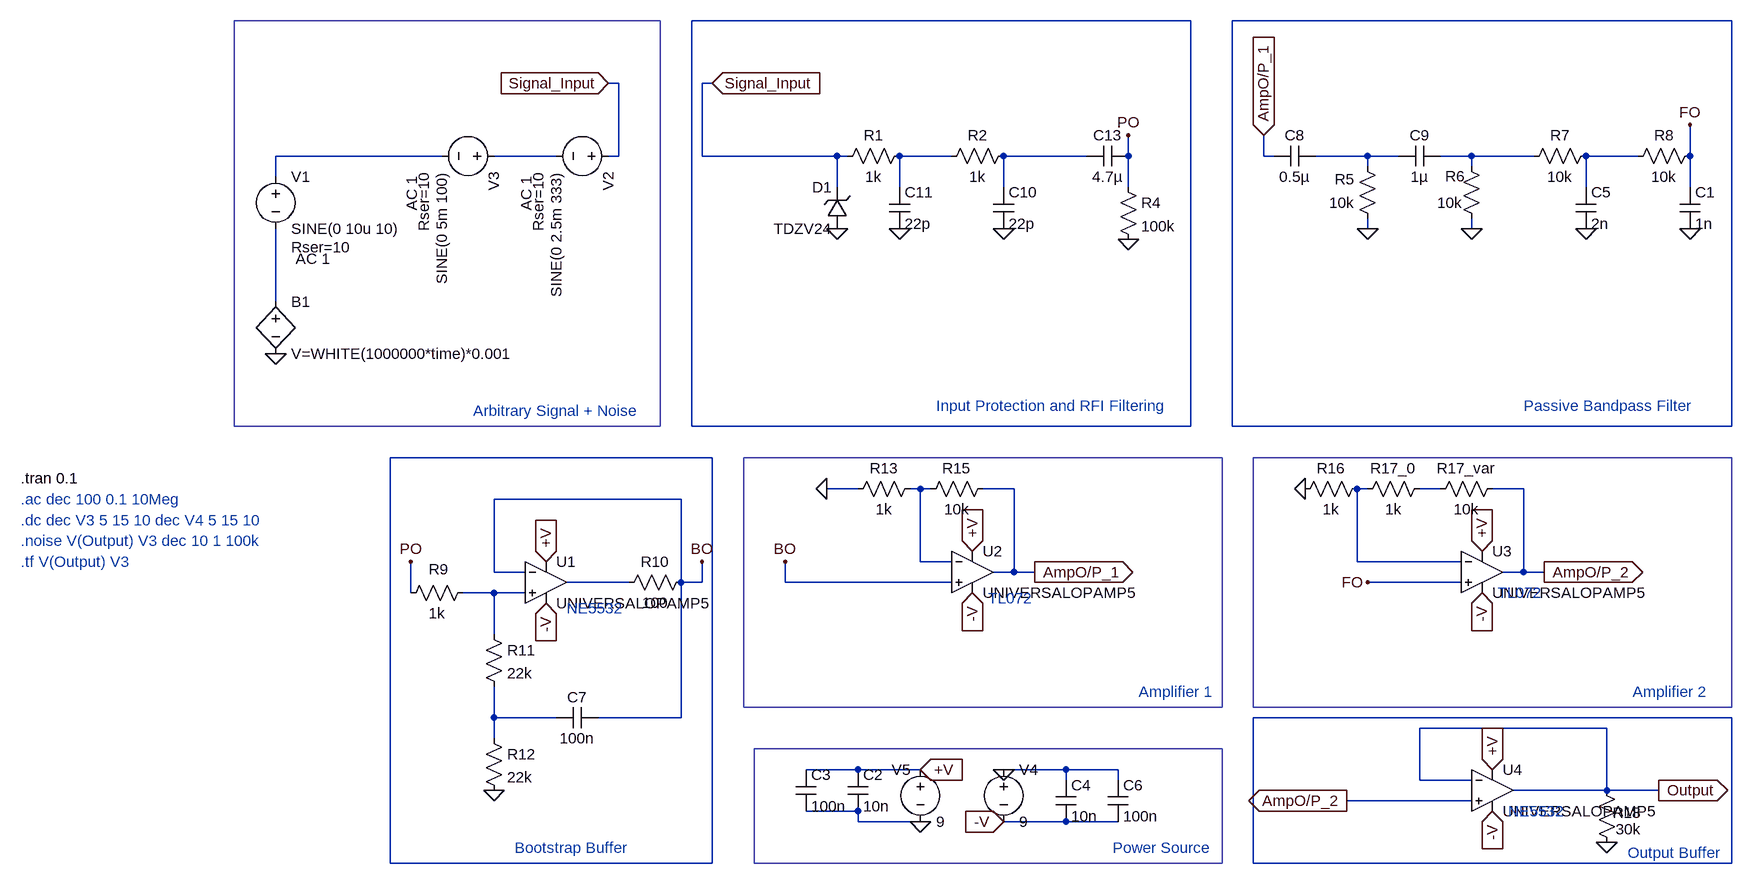
[diagram p0: schematic Low-Level Audio Signal Conditioning Preamplifier.asc]
Low-Level Audio Signal Conditioning Preamplifier.asc, the LTspice schematic file:
Version 4
SHEET 1 4140 1256
WIRE 1152 -48 384 -48
WIRE 1984 -48 1216 -48
WIRE 272 48 256 48
WIRE 416 48 400 48
WIRE 0 160 -256 160
WIRE 176 160 80 160
WIRE 272 160 272 48
WIRE 272 160 256 160
WIRE 400 160 400 48
WIRE 608 160 400 160
WIRE 624 160 608 160
WIRE 784 160 704 160
WIRE 992 160 864 160
WIRE 1056 160 1056 128
WIRE 1264 160 1264 128
WIRE 1280 160 1264 160
WIRE 1424 160 1344 160
WIRE 1472 160 1424 160
WIRE 1584 160 1536 160
WIRE 1680 160 1584 160
WIRE 1840 160 1760 160
WIRE 1920 160 1920 112
WIRE 1424 176 1424 160
WIRE 1584 176 1584 160
WIRE -256 192 -256 160
WIRE 608 208 608 160
WIRE 704 208 704 160
WIRE 864 208 864 160
WIRE 1056 208 1056 160
WIRE 1760 208 1760 160
WIRE 1920 208 1920 160
WIRE 1424 272 1424 256
WIRE 1584 272 1584 256
WIRE -256 384 -256 272
WIRE 384 576 384 -48
WIRE 1152 576 1152 -48
WIRE 1152 576 384 576
WIRE 1216 576 1216 -48
WIRE 1984 576 1984 -48
WIRE 1984 576 1216 576
WIRE 416 624 -80 624
WIRE 640 672 592 672
WIRE 736 672 720 672
WIRE 752 672 736 672
WIRE 880 672 832 672
WIRE 1424 672 1408 672
WIRE 1536 672 1504 672
WIRE 1664 672 1616 672
WIRE 368 688 80 688
WIRE 736 784 736 672
WIRE 784 784 736 784
WIRE 1408 784 1408 672
WIRE 1568 784 1408 784
WIRE 80 800 80 688
WIRE 128 800 80 800
WIRE 880 800 880 672
WIRE 880 800 848 800
WIRE 912 800 880 800
WIRE 1664 800 1664 672
WIRE 1664 800 1632 800
WIRE 1696 800 1664 800
WIRE 288 816 192 816
WIRE 368 816 368 688
WIRE 400 816 400 784
WIRE 400 816 368 816
WIRE 528 816 528 784
WIRE 784 816 528 816
WIRE 1568 816 1424 816
WIRE -48 832 -48 784
WIRE 80 832 32 832
WIRE 128 832 80 832
WIRE 80 896 80 832
WIRE 80 1024 80 976
WIRE 176 1024 80 1024
WIRE 368 1024 368 816
WIRE 368 1024 240 1024
WIRE 1984 1024 1248 1024
WIRE 1792 1040 1504 1040
WIRE 80 1056 80 1024
WIRE 640 1104 560 1104
WIRE 736 1104 640 1104
WIRE 960 1104 864 1104
WIRE 1040 1104 960 1104
WIRE 960 1120 960 1104
WIRE 1040 1120 1040 1104
WIRE 1504 1120 1504 1040
WIRE 1584 1120 1504 1120
WIRE 1792 1136 1792 1040
WIRE 1792 1136 1648 1136
WIRE 1872 1136 1792 1136
WIRE 1584 1152 1392 1152
WIRE 640 1168 560 1168
WIRE 640 1184 640 1168
WIRE 736 1184 640 1184
WIRE 960 1184 864 1184
WIRE 1040 1184 960 1184
WIRE -80 1248 -80 624
WIRE 416 1248 416 624
WIRE 416 1248 -80 1248
WIRE 1248 1248 1248 1024
WIRE 1984 1248 1984 1024
WIRE 1984 1248 1248 1248
FLAG 1920 272 0
FLAG 736 1184 0
FLAG 864 1104 0
FLAG 592 672 0
FLAG 736 1104 +V
IOPIN 736 1104 In
FLAG 864 1184 -V
IOPIN 864 1184 In
FLAG -256 464 0
FLAG 1760 272 0
FLAG 80 1136 0
FLAG 160 784 +V
IOPIN 160 784 In
FLAG 816 768 +V
IOPIN 816 768 In
FLAG 816 832 -V
IOPIN 816 832 In
FLAG 912 800 AmpO/P_1
IOPIN 912 800 Out
FLAG 1264 128 AmpO/P_1
IOPIN 1264 128 In
FLAG 400 784 BO
FLAG 1584 272 0
FLAG 1424 272 0
FLAG 1920 112 FO
FLAG -48 784 PO
FLAG 256 48 Signal_Input
IOPIN 256 48 In
FLAG 160 848 -V
IOPIN 160 848 In
FLAG 528 784 BO
FLAG 1328 672 0
FLAG 1792 1216 0
FLAG 1600 768 +V
IOPIN 1600 768 In
FLAG 1600 832 -V
IOPIN 1600 832 In
FLAG 1696 800 AmpO/P_2
IOPIN 1696 800 Out
FLAG 1424 816 FO
FLAG 864 272 0
FLAG 704 272 0
FLAG 416 48 Signal_Input
IOPIN 416 48 In
FLAG 1056 128 PO
FLAG 1616 1104 +V
IOPIN 1616 1104 In
FLAG 1616 1168 -V
IOPIN 1616 1168 In
FLAG 1392 1152 AmpO/P_2
IOPIN 1392 1152 Out
FLAG 1872 1136 Output
IOPIN 1872 1136 Out
FLAG 1056 288 0
FLAG 608 272 0
SYMBOL voltage -256 176 R0
WINDOW 123 31 142 Left 2
WINDOW 39 24 124 Left 2
SYMATTR Value2 AC 1
SYMATTR SpiceLine Rser=10
SYMATTR InstName V1
SYMATTR Value SINE(0 10u 10)
SYMBOL res 1936 144 R90
WINDOW 0 0 56 VBottom 2
WINDOW 3 32 56 VTop 2
SYMATTR InstName R8
SYMATTR Value 10k
SYMBOL cap 1904 208 R0
SYMATTR InstName C1
SYMATTR Value 1n
SYMBOL voltage 736 1088 R0
WINDOW 123 0 0 Left 0
WINDOW 39 0 0 Left 0
WINDOW 0 -44 16 Left 2
SYMATTR InstName V5
SYMATTR Value 9
SYMBOL voltage 864 1088 R0
WINDOW 123 0 0 Left 0
WINDOW 39 0 0 Left 0
SYMATTR InstName V4
SYMATTR Value 9
SYMBOL res 736 656 R90
WINDOW 0 0 56 VBottom 2
WINDOW 3 32 56 VTop 2
SYMATTR InstName R13
SYMATTR Value 1k
SYMBOL res 848 656 R90
WINDOW 0 0 56 VBottom 2
WINDOW 3 32 56 VTop 2
SYMATTR InstName R15
SYMATTR Value 10k
SYMBOL res 48 816 R90
WINDOW 0 -5 53 VBottom 2
WINDOW 3 32 56 VTop 2
SYMATTR InstName R9
SYMATTR Value 1k
SYMBOL bv -256 368 R0
SYMATTR InstName B1
SYMATTR Value V=WHITE(1000000*time)*0.001
SYMBOL res 1776 144 R90
WINDOW 0 0 56 VBottom 2
WINDOW 3 32 56 VTop 2
SYMATTR InstName R7
SYMATTR Value 10k
SYMBOL cap 1744 208 R0
SYMATTR InstName C5
SYMATTR Value 2n
SYMBOL voltage 272 160 R90
WINDOW 123 31 142 Left 2
WINDOW 39 24 124 Left 2
SYMATTR Value2 AC 1
SYMATTR SpiceLine Rser=10
SYMATTR InstName V2
SYMATTR Value SINE(0 2.5m 333)
SYMBOL voltage 96 160 R90
WINDOW 123 31 142 Left 2
WINDOW 39 24 124 Left 2
SYMATTR Value2 AC 1
SYMATTR SpiceLine Rser=10
SYMATTR InstName V3
SYMATTR Value SINE(0 5m 100)
SYMBOL cap 624 1104 R0
SYMATTR InstName C2
SYMATTR Value 10n
SYMBOL cap 544 1104 R0
SYMATTR InstName C3
SYMATTR Value 100n
SYMBOL cap 944 1120 R0
SYMATTR InstName C4
SYMATTR Value 10n
SYMBOL cap 1024 1120 R0
SYMATTR InstName C6
SYMATTR Value 100n
SYMBOL res 64 880 R0
SYMATTR InstName R11
SYMATTR Value 22k
SYMBOL res 64 1040 R0
SYMATTR InstName R12
SYMATTR Value 22k
SYMBOL cap 240 1008 R90
WINDOW 0 0 32 VBottom 2
WINDOW 3 32 32 VTop 2
SYMATTR InstName C7
SYMATTR Value 100n
SYMBOL res 1600 272 R180
WINDOW 0 26 81 Left 2
WINDOW 3 30 40 Left 2
SYMATTR InstName R6
SYMATTR Value 10k
SYMBOL res 1440 272 R180
WINDOW 0 36 76 Left 2
WINDOW 3 36 40 Left 2
SYMATTR InstName R5
SYMATTR Value 10k
SYMBOL cap 1344 144 R90
WINDOW 0 0 32 VBottom 2
WINDOW 3 32 32 VTop 2
SYMATTR InstName C8
SYMATTR Value 0.5µ
SYMBOL cap 1536 144 R90
WINDOW 0 0 32 VBottom 2
WINDOW 3 32 32 VTop 2
SYMATTR InstName C9
SYMATTR Value 1µ
SYMBOL res 384 800 R90
WINDOW 0 0 56 VBottom 2
WINDOW 3 32 56 VTop 2
SYMATTR InstName R10
SYMATTR Value 100
SYMBOL res 1424 656 R90
WINDOW 0 0 56 VBottom 2
WINDOW 3 32 56 VTop 2
SYMATTR InstName R16
SYMATTR Value 1k
SYMBOL res 1632 656 R90
WINDOW 0 0 56 VBottom 2
WINDOW 3 32 56 VTop 2
SYMATTR InstName R17_var
SYMATTR Value 10k
SYMBOL res 1776 1120 R0
WINDOW 0 25 50 Left 2
WINDOW 3 30 76 Left 2
SYMATTR InstName R18
SYMATTR Value 30k
SYMBOL res 880 144 R90
WINDOW 0 0 56 VBottom 2
WINDOW 3 32 56 VTop 2
SYMATTR InstName R2
SYMATTR Value 1k
SYMBOL cap 848 208 R0
SYMATTR InstName C10
SYMATTR Value 22p
SYMBOL res 720 144 R90
WINDOW 0 0 56 VBottom 2
WINDOW 3 32 56 VTop 2
SYMATTR InstName R1
SYMATTR Value 1k
SYMBOL cap 688 208 R0
SYMATTR InstName C11
SYMATTR Value 22p
SYMBOL zener 624 272 R180
WINDOW 0 24 64 Left 2
WINDOW 3 24 0 Left 2
SYMATTR InstName D1
SYMATTR Value TDZV24
SYMATTR Description Diode
SYMATTR Type diode
SYMBOL cap 1056 144 R90
WINDOW 0 0 32 VBottom 2
WINDOW 3 32 32 VTop 2
SYMATTR InstName C13
SYMATTR Value 4.7µ
SYMBOL OpAmps\\UniversalOpAmp5 816 800 R0
SYMATTR InstName U2
SYMATTR Value2 Avol=794328 GBW=5.25Meg Phimargin=56 SlewPos=20Meg SlewNeg=20Meg
SYMATTR SpiceLine En=37n Enk=0 In=80f Ink=0 Rcm=1T Ccm=1p Rdiff=500k Cdiff=2p Ro=125
SYMATTR SpiceLine2 Vos=1m Ibp=1p Ibn=1p Iq=940u Rail=0 Ilimit=25m
SYMBOL res 1040 192 R0
SYMATTR InstName R4
SYMATTR Value 100k
SYMBOL OpAmps\\UniversalOpAmp5 1600 800 R0
SYMATTR InstName U3
SYMATTR Value2 Avol=794328 GBW=5.25Meg Phimargin=56 SlewPos=20Meg SlewNeg=20Meg
SYMATTR SpiceLine En=37n Enk=0 In=80f Ink=0 Rcm=1T Ccm=1p Rdiff=500k Cdiff=2p Ro=125
SYMATTR SpiceLine2 Vos=1m Ibp=1p Ibn=1p Iq=940u Rail=0 Ilimit=25m
SYMBOL OpAmps\\UniversalOpAmp5 160 816 R0
SYMATTR InstName U1
SYMATTR Value2 Avol=300k GBW=10Meg Phimargin=65 SlewPos=5Meg SlewNeg=5Meg
SYMATTR SpiceLine En=5n Enk=0 In=0.7p Ink=0 Rcm=300Meg Ccm=2p Rdiff=600k Cdiff=2p Ro=50
SYMATTR SpiceLine2 Vos=0.5m Ibp=200n Ibn=200n Iq=8m Rail=2 Ilimit=25m
SYMBOL OpAmps\\UniversalOpAmp5 1616 1136 R0
SYMATTR InstName U4
SYMATTR Value2 Avol=300k GBW=10Meg Phimargin=65 SlewPos=5Meg SlewNeg=5Meg
SYMATTR SpiceLine En=5n Enk=0 In=0.7p Ink=0 Rcm=300Meg Ccm=2p Rdiff=600k Cdiff=2p Ro=50
SYMATTR SpiceLine2 Vos=0.5m Ibp=200n Ibn=200n Iq=8m Rail=2 Ilimit=25m
SYMBOL res 1520 656 R90
WINDOW 0 0 56 VBottom 2
WINDOW 3 32 56 VTop 2
SYMATTR InstName R17_0
SYMATTR Value 1k
TEXT -648 688 Left 2 ;.ac dec 100 0.1 10Meg
TEXT -648 656 Left 2 !.tran 0.1
TEXT 48 552 Left 2 ;Arbitrary Signal + Noise
TEXT 1664 544 Left 2 ;Passive Bandpass Filter
TEXT 112 1224 Left 2 ;Bootstrap Buffer
TEXT 1072 984 Left 2 ;Amplifier 1
TEXT 1032 1224 Left 2 ;Power Source
TEXT 1832 984 Left 2 ;Amplifier 2
TEXT 760 544 Left 2 ;Input Protection and RFI Filtering
TEXT 1824 1232 Left 2 ;Output Buffer
TEXT 840 840 Left 2 ;TL072
TEXT 1624 832 Left 2 ;TL072
TEXT -648 720 Left 2 ;.dc dec V3 5 15 10 dec V4 5 15 10
TEXT -648 752 Left 2 ;.noise V(Output) V3 dec 10 1 100k
TEXT -648 784 Left 2 ;.tf V(Output) V3
TEXT 192 856 Left 2 ;NE5532
TEXT 1640 1168 Left 2 ;NE5532
RECTANGLE Normal 336 576 -320 -48
RECTANGLE Normal 1200 1008 464 624
RECTANGLE Normal 1200 1248 480 1072
RECTANGLE Normal 1984 1008 1248 624

The netlist it stands for:
* Low-Level Audio Signal Conditioning Preamplifier.asc
V1 N003 N010 SINE(0 10u 10) AC 1 Rser=10
R8 FO N009 10k
C1 FO 0 1n
V5 +V 0 9
V4 0 -V 9
R13 N012 0 1k
R15 AmpO/P_1 N012 10k
R9 N016 PO 1k
B1 N010 0 V=WHITE(1000000*time)*0.001
R7 N009 N008 10k
C5 N009 0 2n
V2 Signal_Input N004 SINE(0 2.5m 333) AC 1 Rser=10
V3 N004 N003 SINE(0 5m 100) AC 1 Rser=10
C2 +V 0 10n
C3 +V 0 100n
C4 0 -V 10n
C6 0 -V 100n
R11 N016 N017 22k
R12 N017 0 22k
C7 BO N017 100n
R6 0 N008 10k
R5 0 N007 10k
C8 N007 AmpO/P_1 0.5µ
C9 N008 N007 1µ
R10 BO N015 100
R16 N013 0 1k
R17_var AmpO/P_2 N014 10k
R18 Output 0 30k
R2 N006 N005 1k
C10 N006 0 22p
R1 N005 Signal_Input 1k
C11 N005 0 22p
D1 0 Signal_Input TDZV24
C13 PO N006 4.7µ
XU2 BO N012 +V -V AmpO/P_1 Avol=794328 GBW=5.25Meg Phimargin=56 SlewPos=20Meg SlewNeg=20Meg En=37n Enk=0 In=80f Ink=0 Rcm=1T Ccm=1p Rdiff=500k Cdiff=2p Ro=125 Vos=1m Ibp=1p Ibn=1p Iq=940u Rail=0 Ilimit=25m  ; UNIVERSALOPAMP5, pins In+ In- V+ V- OUT
R4 PO 0 100k
XU3 FO N013 +V -V AmpO/P_2 Avol=794328 GBW=5.25Meg Phimargin=56 SlewPos=20Meg SlewNeg=20Meg En=37n Enk=0 In=80f Ink=0 Rcm=1T Ccm=1p Rdiff=500k Cdiff=2p Ro=125 Vos=1m Ibp=1p Ibn=1p Iq=940u Rail=0 Ilimit=25m  ; UNIVERSALOPAMP5, pins In+ In- V+ V- OUT
XU1 N016 BO +V -V N015 Avol=300k GBW=10Meg Phimargin=65 SlewPos=5Meg SlewNeg=5Meg En=5n Enk=0 In=0.7p Ink=0 Rcm=300Meg Ccm=2p Rdiff=600k Cdiff=2p Ro=50 Vos=0.5m Ibp=200n Ibn=200n Iq=8m Rail=2 Ilimit=25m  ; UNIVERSALOPAMP5, pins In+ In- V+ V- OUT
XU4 AmpO/P_2 Output +V -V Output Avol=300k GBW=10Meg Phimargin=65 SlewPos=5Meg SlewNeg=5Meg En=5n Enk=0 In=0.7p Ink=0 Rcm=300Meg Ccm=2p Rdiff=600k Cdiff=2p Ro=50 Vos=0.5m Ibp=200n Ibn=200n Iq=8m Rail=2 Ilimit=25m  ; UNIVERSALOPAMP5, pins In+ In- V+ V- OUT
R17_0 N014 N013 1k
.model D D
.lib standard.dio
* .ac dec 100 0.1 10Meg
.tran 0.1
* Arbitrary Signal + Noise
* Passive Bandpass Filter
* Bootstrap Buffer
* Amplifier 1
* Power Source
* Amplifier 2
* Input Protection and RFI Filtering
* Output Buffer
* TL072
* TL072
* .dc dec V3 5 15 10 dec V4 5 15 10
* .noise V(Output) V3 dec 10 1 100k
* .tf V(Output) V3
* NE5532
* NE5532
.backanno
.end